# Altium schematic sheet ZUM_Core_Autoreset.SchDoc: ZUM Core Autoreset
size A4; Author: Andrés Gullón; DocumentNumber: 9; SheetNumber: 9; SheetTotal: 9
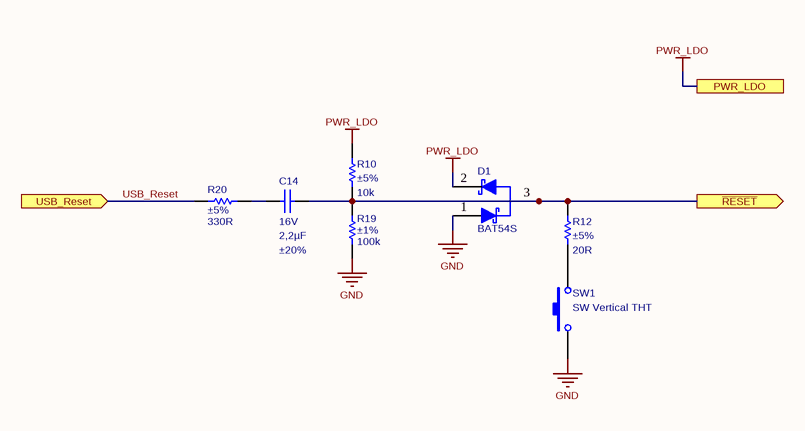
[diagram p0: ZUM_Core_Autoreset.SchDoc]

## Parts
C14  Voltage: 16V  Capacitance: 2,2µF  Tolerance: ±20%  [C0402]  (hidden comment: C0402_2.2uF_16V_±20%)
D1  BAT54S  [SOT23-3]
R10  Tolerance: ±5%  Resistance: 10k  [R0402]  (hidden comment: R0402_10k_0.063W_±5%)
R12  Tolerance: ±5%  Resistance: 20R  [R0402]  (hidden comment: R0402_20R_0.063W_±5%)
R19  Tolerance: ±1%  Resistance: 100k  [R0402]  (hidden comment: R0402_100k_0.063W_±1%)
R20  Tolerance: ±5%  Resistance: 330R  [R0402]  (hidden comment: R0402_330R_0.063W_±5%)
SW1  SW Vertical THT  [SW_Vert_THT_7.5x6x6.5]

## Ports
PWR_LDO, USB_Reset (in), ~{RESET} (out)

## Nets
GND: D1.1(A) R19.2 SW1.1
PWR_LDO: D1.2(K2) R10.1 ; port PWR_LDO
~{RESET}: C14.1 D1.3(K1) R10.2 R12.2 R19.1 ; port ~{RESET}
USB_Reset: R20.2 ; port USB_Reset
NetC14_2: C14.2 R20.1
NetR12_1: R12.1 SW1.2

## Notes on the sheet
- Title
- Project
- Size:
- Author
- A4
- Number:
- Revision:
- Mundo Reader, S.L. This project and all the sheets and layouts enclosed are licensed under Creative Commons by Attribution and Share Alike [CC BY-SA] (www.creativecommons.com)
- Date:
- Time:
- Sheet
- of

## Library data of the parts
C14 = CMP-A0550-4: C0402_2.2uF_16V_±20%_X5R; Part Number: C0402_2.2uF_16V_±10%; Manufacturer: TDK; Value: 2,2µF ±20% 16V; Dielectric: X5R; OrderingCode: C1005X5R1C225M050BC; Temp_ Max: 125; Temp_ Min: -55; AccessRights: 2147483647; ContentType: Component; Description ES: Condensador; Folder: Components Library\Pasives\Capacitor_SMD\C0402_16V$\; OrderingCode 2: EMK105ABJ225MV-F; RevisionId: 3; SchLibComponentName: Capacitor; Price units: EUR; ComponentType: Capacitor; ContentTypeGUID: CB3C11C4-E317-11DF-B822-12313F0024A2; FolderGUID: B1BE7916-43F7-4918-A273-F24409A7170B; ItemGUID: BD471B44-C1FF-4F80-85CC-AC0CC62DE9EE; ItemHRID: CMP-A0550; LifeCycle: New From Design; LifeCycleStateGUID: 706004B5-C76E-482E-903B-BA0E4FAE086A; Manufacturer 2: Taiyo Yuden; ReleaseDate: 04/09/2017 08:02:11 AM
D1 = CMP-A2299-1: Schottky Diode; Manufacturer: NXP; SchLibComponentName: Dual Schottky; Ifor: 200mA; Vrrm: 30V; Ifsm: 600mA; Vf: 0,8V; Description ES: Diodo Schottky; Temp_Max: 150; Temp_Min: -55; Value: 200mA 30V; Part Number: BAT54S; OrderingCode: BAT54S; Supplier cod: AC1190; Price units: EUR; Manufacturer 2: Vishay; OrderingCode 2: BAT54S
R10 = CMP-A1692-4: Manufacturer: Vishay; Value: 10k ±5% 0.063W; SchLibComponentName: Resistor; OrderingCode: CRCW040210K0JN; Power: 0.063W; Temp_ Max: 155; Temp_ Min: -55; Description ES: Resistencia; OrderingCode 2: RC0402JR-0710KL; Temp_Max: 155°C; Temp_Min: -55°C; PackageDescription: SMD; Part Number: R0402_10k_0.063W_±5%; Price units: EUR; Manufacturer 2: Yageo
R12 = CMP-A1736-5: Manufacturer: Vishay; OrderingCode: CRCW040220R0JN; Power: 0.063W; Value: 20R ±5% 0.063W; Temp_ Max: 155; Temp_ Min: -55; Description ES: Resistencia; SchLibComponentName: Resistor; PackageDescription: SMD; Part Number: R0402_20R_0.063W_±5%; Price units: EUR
R19 = CMP-A1835-1: Manufacturer: Vishay; Value: 100k ±1% 0.063W; OrderingCode: CRCW0402100KFK; Power: 0.063W; Temp_ Max: 155; Temp_ Min: -55; SchLibComponentName: Resistor; PackageDescription: SMD; Part Number: R0402_100k_0.063W_±1%; Price units: EUR
R20 = CMP-A1762-2: Manufacturer: Vishay; SchLibComponentName: Resistor; OrderingCode: CRCW0402330RJN; Power: 0.063W; Value: 330R ±5% 0.063W; Temp_ Max: 155; Temp_ Min: -55; Description ES: Resistencia; PackageDescription: SMD; Part Number: R0402_330R_0.063W_±5%; Price units: EUR
SW1 = CMP-A2468-2: Switch; Manufacturer: C&K Components; OrderingCode: PTS645VL39-2 LFS; Description ES: Pulsador; Temp_ Max: 60; Temp_ Min: -20; Lead time: 11 wks; SchLibComponentName: Switch; Part Number: SW Vertical THT; Price units: EUR